# EAGLE schematic RPI4 Power Cable (EAGLE 9.6.2)
DRAWING_REV: A
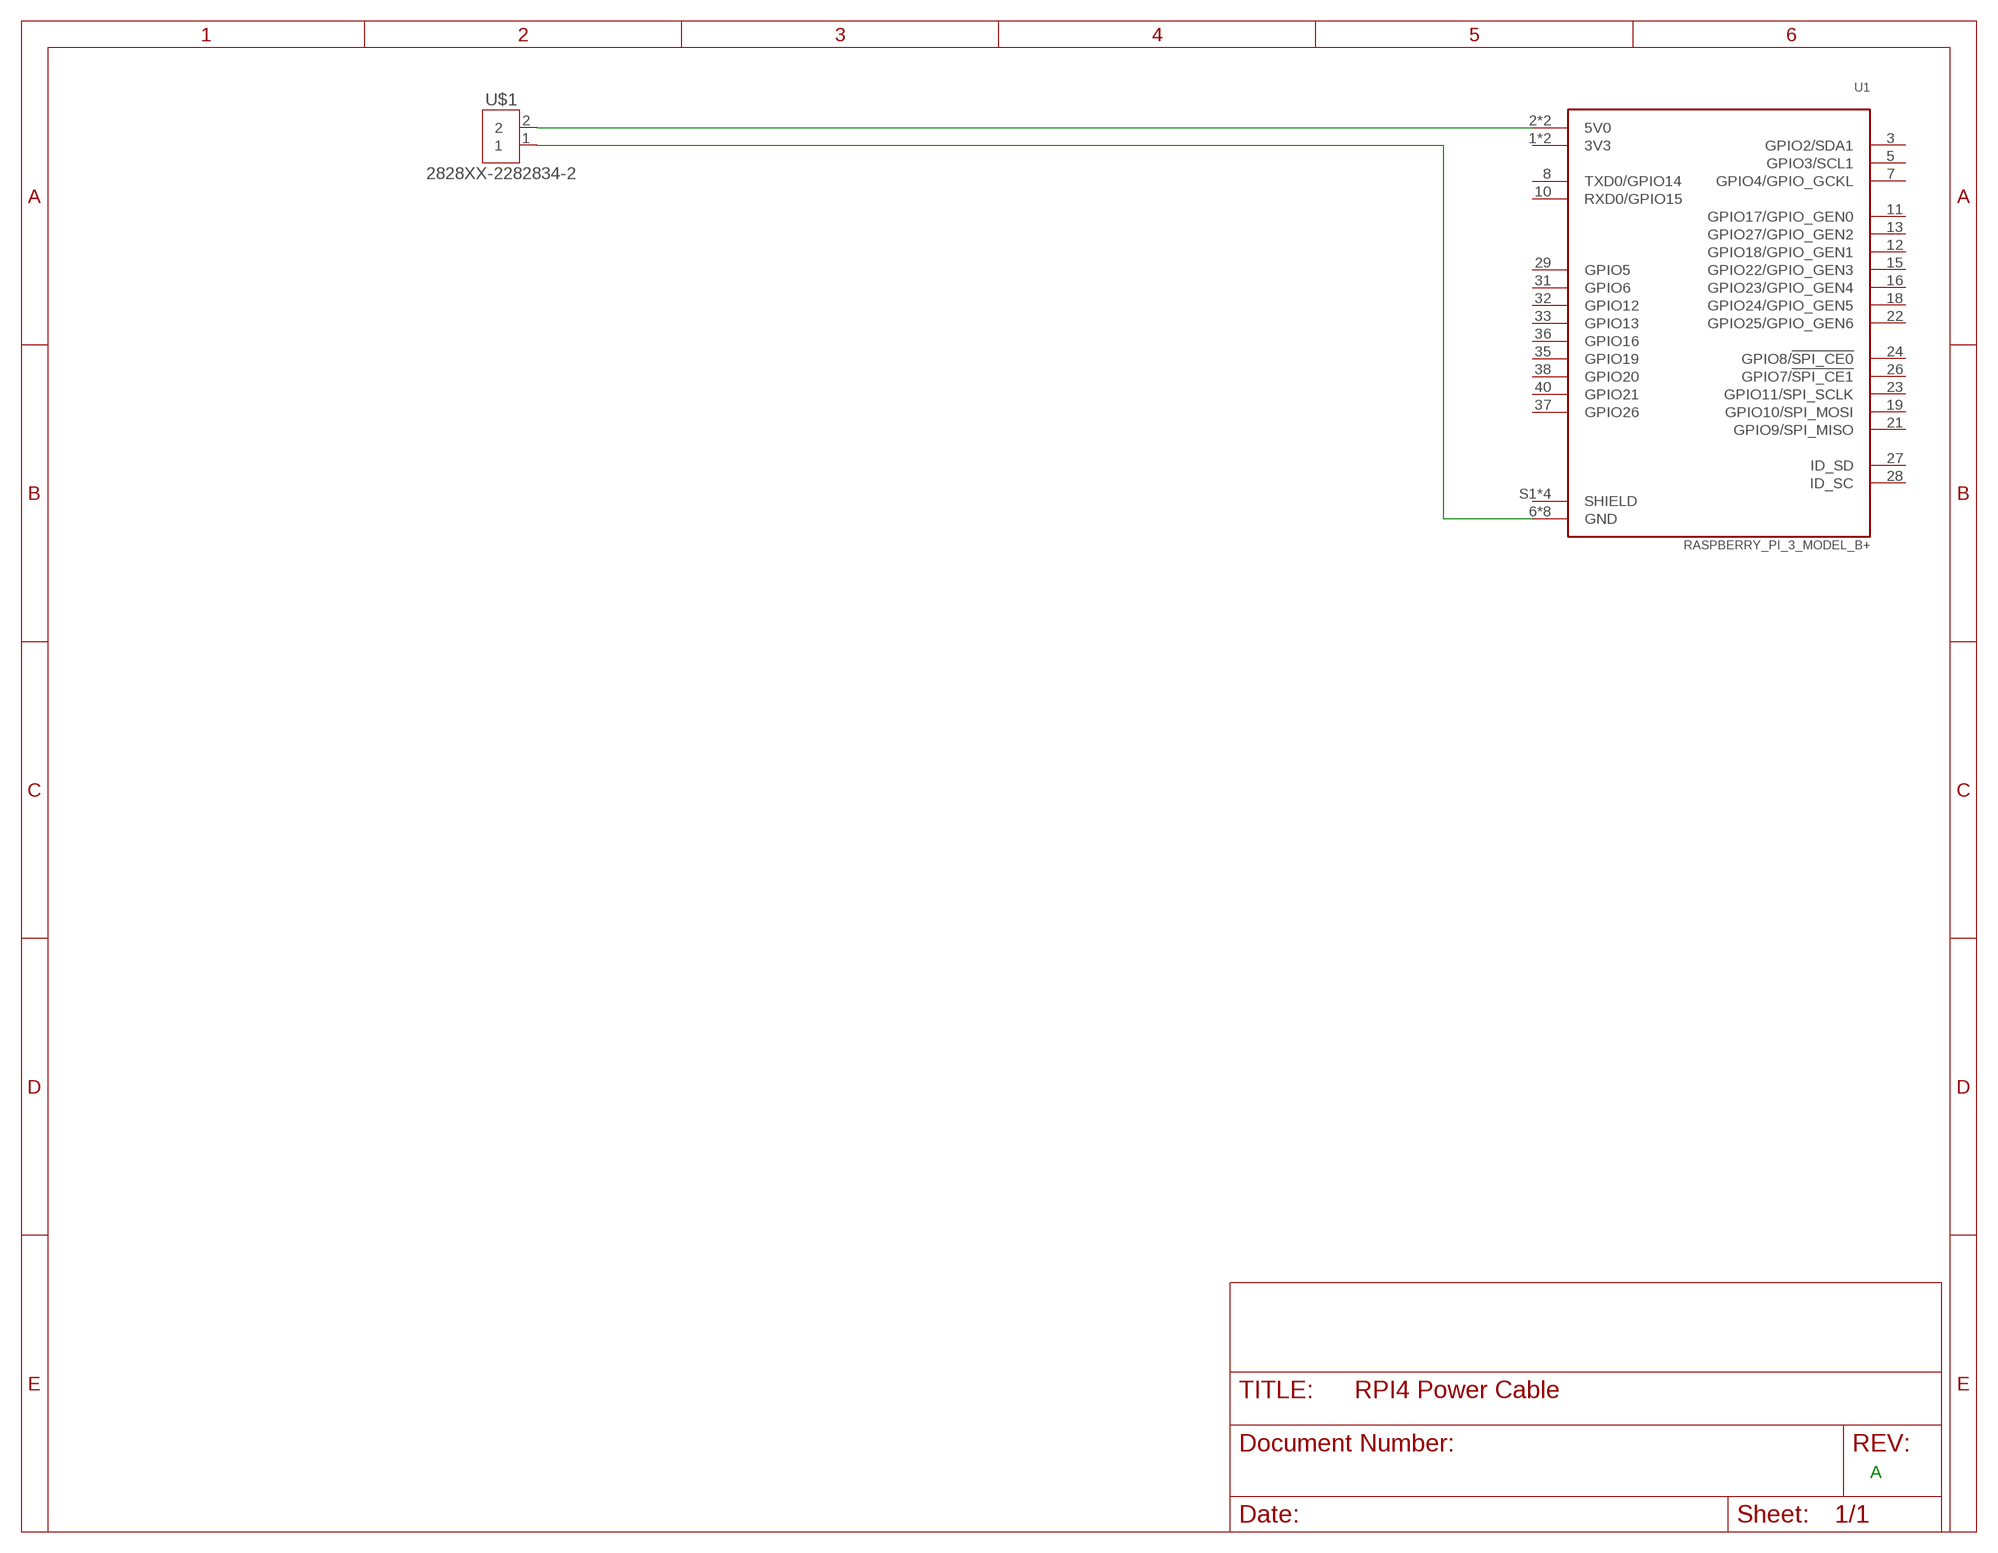
[diagram p0: schematic, sheet 1]

## Parts
U1  RASPBERRY_PI_3_MODEL_B+  [MODULE_RASPBERRY_PI_3_MODEL_B+]
U$1  2828XX-2282834-2  [TERMBLK_254-2N]

## Nets
N$1: U1.2(5V0) U1.4(5V0) U$1.2
N$2: U1.6(GND) U1.9(GND) U1.14(GND) U1.20(GND) U1.25(GND) U1.30(GND) U1.34(GND) U1.39(GND) U$1.1
Unconnected: U1.3(GPIO2/SDA1) U1.5(GPIO3/SCL1) U1.7(GPIO4/GPIO_GCKL) U1.8(TXD0/GPIO14) U1.10(RXD0/GPIO15) U1.11(GPIO17/GPIO_GEN0) U1.12(GPIO18/GPIO_GEN1) U1.13(GPIO27/GPIO_GEN2) U1.15(GPIO22/GPIO_GEN3) U1.16(GPIO23/GPIO_GEN4) U1.18(GPIO24/GPIO_GEN5) U1.19(GPIO10/SPI_MOSI) U1.21(GPIO9/SPI_MISO) U1.22(GPIO25/GPIO_GEN6) U1.23(GPIO11/SPI_SCLK) U1.24(GPIO8/!SPI_CE0!) U1.26(GPIO7/!SPI_CE1!) U1.27(ID_SD) U1.28(ID_SC) U1.29(GPIO5) U1.31(GPIO6) U1.32(GPIO12) U1.33(GPIO13) U1.35(GPIO19) U1.36(GPIO16) U1.37(GPIO26) U1.38(GPIO20) U1.40(GPIO21)

## Power pins joined to a net without a drawn wire
3V3: U1.1(3V3) U1.17(3V3)
SHIELD: U1.S1(SHIELD) U1.S2(SHIELD) U1.S3(SHIELD) U1.S4(SHIELD)

## Library data of the parts
U1 = RASPBERRY_PI_3_MODEL_B_:RASPBERRY_PI_3_MODEL_B+: BCM2835 Raspberry Pi Model B+ - ARM11, VideoCore MPU Embedded Evaluation Board Check prices <https://pricing.snapeda.com/parts/RASPBERRY%20PI%203%20MODEL%20B%2B/Raspberry%20Pi/view-part?ref=eda>; AVAILABILITY: No availability data; DESCRIPTION: RASPBERRY PI 3 MOD B+ BCM2837B0; MF: Raspberry Pi; MP: RASPBERRY PI 3 MODEL B+; PACKAGE: Raspberry Pi; PRICE: None
U$1 = Connector:2828XX-2: 2 Position Wire to Board Terminal Block Horizontal with Board Datasheet <https://www.te.com.cn/commerce/DocumentDelivery/DDEController?Action=showdoc&DocId=Catalog+Section%7F1308389_EUROSTYLE_TERMINAL_BLOCKS%7F0607%7Fpdf%7FEnglish%7FENG_CS_1308389_EUROSTYLE_TERMINAL_BLOCKS_0607.pdf%7F2-282837-5>